# EAGLE schematic BoostConverterSim (EAGLE 9.5.1)
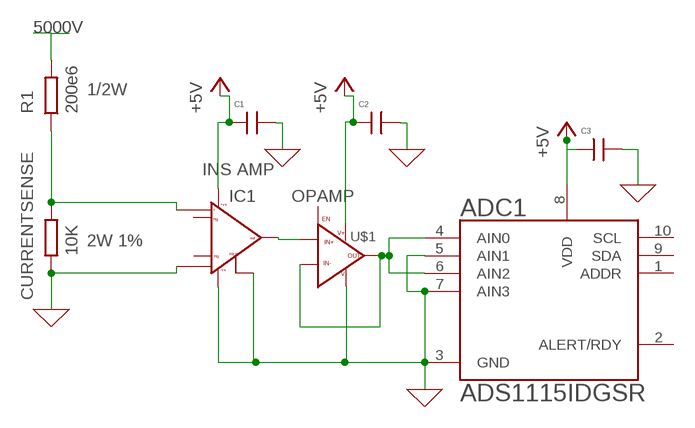
[diagram p0: schematic, sheet 1]

## Parts
ADC1  ADS1115IDGSR  [SOP50P490X110-10N]
C1  CAPACTORFORTRANSFORMER  [C1210C156K8PACTU]
C2  CAPACTORFORTRANSFORMER  [C1210C156K8PACTU]
C3  CAPACTORFORTRANSFORMER  [C1210C156K8PACTU]
CURRENTSENSE  10K  R  (no package)
IC1  INA333  [8-VSSOP]
R1  200e6  R  (no package)
U$1  OPA300-ND  [SOT23-6]

## Nets
0: ADC1.3(GND) ADC1.5(AIN1) ADC1.7(AIN3) C1.P$2 C2.P$2 C3.P$2 CURRENTSENSE.1 IC1.-IN IC1.REF IC1.V-(-VS) U$1.P$2(V-) ; supply symbol labelled GND
5000V: R1.2
+5V: ADC1.8(VDD) C1.P$1 C2.P$1 C3.P$1 IC1.V+(+VS) U$1.P$6(V+)
N$1: IC1.VOUT(OUT) U$1.P$3(IN+)
N$2: CURRENTSENSE.2 IC1.+IN R1.1
N$4: ADC1.4(AIN0) ADC1.6(AIN2) U$1.P$1(OUT) U$1.P$4(IN-)
Unconnected: ADC1.1(ADDR) ADC1.2(ALERT/RDY) ADC1.9(SDA) ADC1.10(SCL) IC1.+RG IC1.-RG(RG-) U$1.P$5(EN)

## Notes on the sheet
- 1/2W
- INS AMP
- OPAMP
- 2W 1%

## Library data of the parts
ADC1 = Ampparts:ADS1115IDGSR: 16-Bit ADC with Integrated MUX, PGA, Comparator, Oscillator, and Reference 10-VSSOP -40 to 125; DESCRIPTION: 16 Bit Analog to Digital Converter 2, 4 Input 1 Sigma-Delta 10-VSSOP; DIGI-KEY_PART_NUMBER: 296-38849-1-ND; MF: Texas Instruments; MP: ADS1115IDGSR; P: 402; PACKAGE: MSOP-10 Texas Instruments; TEXAS_INSTRUMENTS-PURCHASE-URL: https://snapeda.com/shop?store=Texas+Instruments&id=45903
C1-C3 = CAP_Diode_Megger:CAPACTORFORTRANSFORMER: KEMET’s X5R dielectric features an 85°C maximum operating temperature and is considered “semi-stable.” The Electronics Components, Assemblies & Materials Association (EIA) characterizes X5R dielectric as a Class II material. Components of this classification are fixed, ceramic dielectric capacitors suited for bypass and decoupling applications or for frequency discriminating circuits where Q and stability of capacitance characteristics are not critical. X5R exhibits a predictable change in capacitance with respect to time and voltage and boasts a minimal change in capacitance with reference to ambient temperature. Capacitance change is limited to ±15% from −55°C to +85°C Modelled by Athar Zafeer; CAPACITANCE: 15µF; MANUFACTURER: KEMET; P: 90; PACKAGE: 1210; PARTNO: C1210C156K8PACTU; TOLERANCE: ±10%
CURRENTSENSE R1 = ngspice-simulation:R: RESISTOR
IC1 = Ampparts:INA333: Instrumentation Amplifier 1 Circuit Rail-to-Rail 8-VSSOP; MANUFACTURER: Texas Instruments; P: 366; PACKAGE: 8-VSSOP; PARTNO: INA333AIDGKRG4
U$1 = Ampparts:OPA300-ND: The OPA300 and OPA301 series high-speed, voltage-feedback, CMOS operational amplifiers are designed for 16-bit resolution systems. The OPA300/OPA301 series are unity-gain stable and feature excellent settling and harmonic distortion specifications. Low power applications benefit from low quiescent current. The OPA300 and OPA2300 feature a digital shutdown (Enable) function to provide additional power savings during idle periods. Optimized for single-supply operation, the OPA300/OPA301 series offer superior output swing and excellent common-mode range. The OPA300 and OPA301 series op amps have 150MHz of unity-gain bandwidth, low 3nV/√Hz voltage noise, and 0.1% settling within 30ns. Single-supply operation from 2.7V (±1.35V) to 5.5V (±2.75V) and an available shutdown function that reduces supply current to 5µA are useful for portable low-power applications. The OPA300 and OPA301 are available in SO-8 and SOT-23 packages. The OPA2300 is available in MSOP-10, and the OPA2301 is available in SO-8 and MSOP-8. All versions are specified over the industrial temperature range of −40°C to +125°C.; P: 170